# Altium schematic sheet Main.SchDoc
size A4
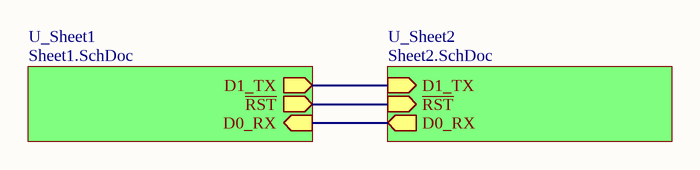
[diagram p0: Main.SchDoc]

## Sub-sheets
U_Sheet1 = Sheet1.SchDoc: D1_TX (out), D0_RX (in), ~{RST} (out)
U_Sheet2 = Sheet2.SchDoc: D1_TX (in), D0_RX (out), ~{RST} (in)

## Nets
(unnamed): sheet U_Sheet1/D1_TX, sheet U_Sheet2/D1_TX
(unnamed): sheet U_Sheet1/D0_RX, sheet U_Sheet2/D0_RX
(unnamed): sheet U_Sheet1/~{RST}, sheet U_Sheet2/~{RST}

## Notes on the sheet
- Title
- Size:
- Date:
- A4
- Number:
- Time:
- Revision:
- Sheet
- of
- File:
- Author: